# EAGLE design wifi-monome (EAGLE 9.1.0)
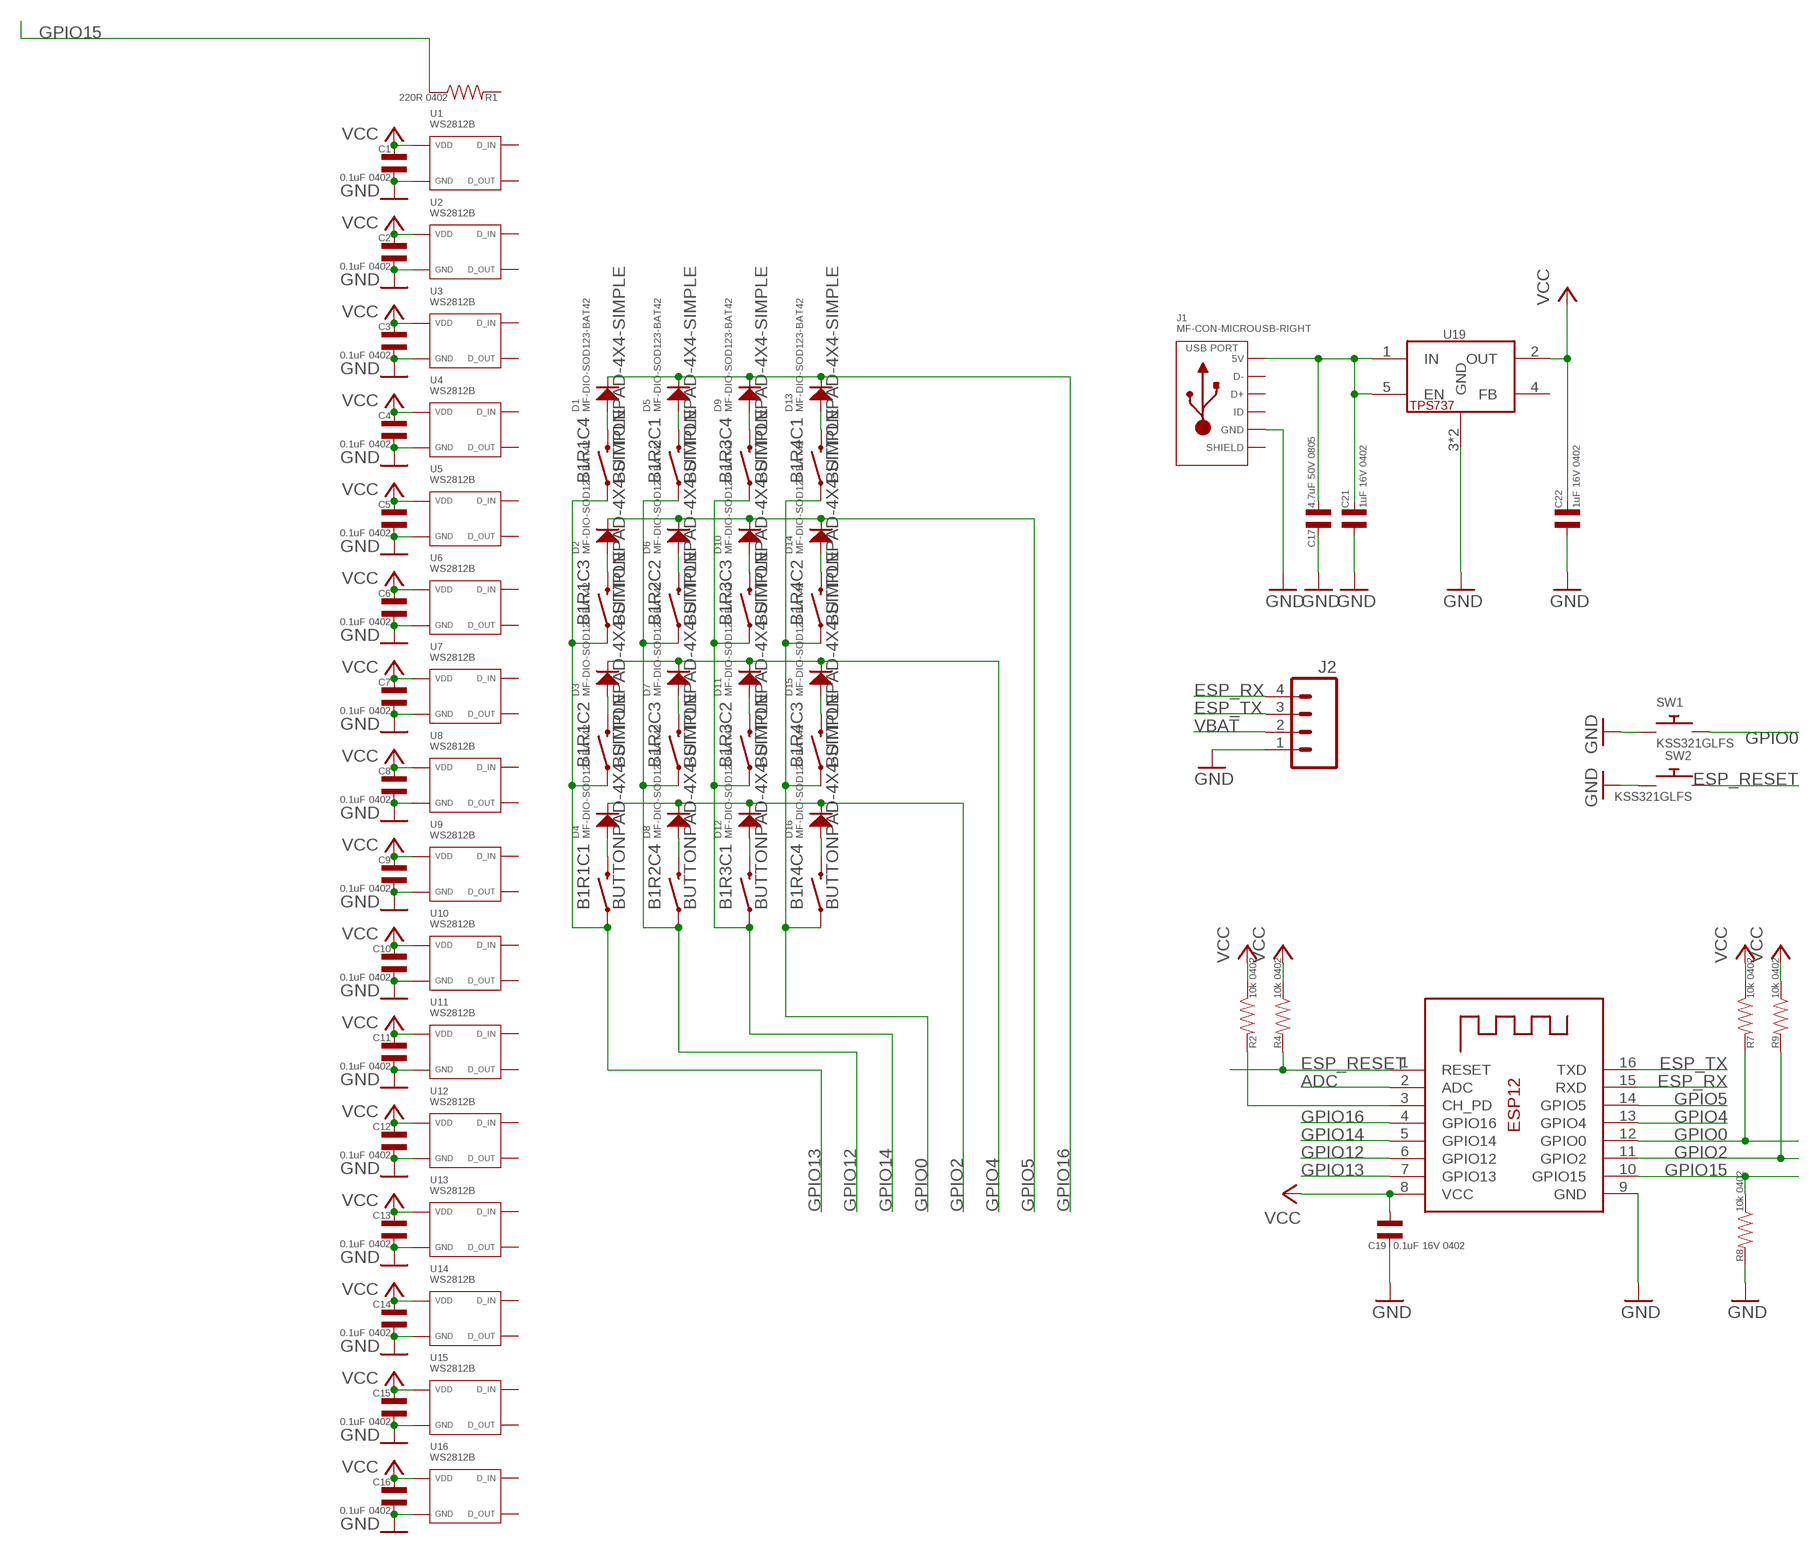
[diagram p0: schematic, sheet 1]

## Parts
B1  BUTTONPAD-4X4-SIMPLE  [BUTTONPAD-4X4-SIMPLE]
C1  0.1uF 0402  CAPACITOR_NP_0402  [C0402]
C2  0.1uF 0402  CAPACITOR_NP_0402  [C0402]
C3  0.1uF 0402  CAPACITOR_NP_0402  [C0402]
C4  0.1uF 0402  CAPACITOR_NP_0402  [C0402]
C5  0.1uF 0402  CAPACITOR_NP_0402  [C0402]
C6  0.1uF 0402  CAPACITOR_NP_0402  [C0402]
C7  0.1uF 0402  CAPACITOR_NP_0402  [C0402]
C8  0.1uF 0402  CAPACITOR_NP_0402  [C0402]
C9  0.1uF 0402  CAPACITOR_NP_0402  [C0402]
C10  0.1uF 0402  CAPACITOR_NP_0402  [C0402]
C11  0.1uF 0402  CAPACITOR_NP_0402  [C0402]
C12  0.1uF 0402  CAPACITOR_NP_0402  [C0402]
C13  0.1uF 0402  CAPACITOR_NP_0402  [C0402]
C14  0.1uF 0402  CAPACITOR_NP_0402  [C0402]
C15  0.1uF 0402  CAPACITOR_NP_0402  [C0402]
C16  0.1uF 0402  CAPACITOR_NP_0402  [C0402]
C17  4.7uF 50V 0805  CAPACITOR_NP_0805  [C0805]
C19  0.1uF 16V 0402  CAPACITOR_NP_0402  [C0402]
C21  1uF 16V 0402  CAPACITOR_NP_0402  [C0402]
C22  1uF 16V 0402  CAPACITOR_NP_0402  [C0402]
D1  MF-DIO-SOD123-BAT42  DIODES_BAT42_SOD-123  [SOD-123]
D2  MF-DIO-SOD123-BAT42  DIODES_BAT42_SOD-123  [SOD-123]
D3  MF-DIO-SOD123-BAT42  DIODES_BAT42_SOD-123  [SOD-123]
D4  MF-DIO-SOD123-BAT42  DIODES_BAT42_SOD-123  [SOD-123]
D5  MF-DIO-SOD123-BAT42  DIODES_BAT42_SOD-123  [SOD-123]
D6  MF-DIO-SOD123-BAT42  DIODES_BAT42_SOD-123  [SOD-123]
D7  MF-DIO-SOD123-BAT42  DIODES_BAT42_SOD-123  [SOD-123]
D8  MF-DIO-SOD123-BAT42  DIODES_BAT42_SOD-123  [SOD-123]
D9  MF-DIO-SOD123-BAT42  DIODES_BAT42_SOD-123  [SOD-123]
D10  MF-DIO-SOD123-BAT42  DIODES_BAT42_SOD-123  [SOD-123]
D11  MF-DIO-SOD123-BAT42  DIODES_BAT42_SOD-123  [SOD-123]
D12  MF-DIO-SOD123-BAT42  DIODES_BAT42_SOD-123  [SOD-123]
D13  MF-DIO-SOD123-BAT42  DIODES_BAT42_SOD-123  [SOD-123]
D14  MF-DIO-SOD123-BAT42  DIODES_BAT42_SOD-123  [SOD-123]
D15  MF-DIO-SOD123-BAT42  DIODES_BAT42_SOD-123  [SOD-123]
D16  MF-DIO-SOD123-BAT42  DIODES_BAT42_SOD-123  [SOD-123]
J1  MF-CON-MICROUSB-RIGHT  USB_MICRO_RIGHT  [MICROUSB-RIGHT]
J2  M04SMD_RA_FEMALE  [1X04_SMD_RA_FEMALE]
R1  220R 0402  RESISTOR_0402  [R0402]
R2  10k 0402  RESISTOR_0402  [R0402]
R4  10k 0402  RESISTOR_0402  [R0402]
R7  10k 0402  RESISTOR_0402  [R0402]
R8  10k 0402  RESISTOR_0402  [R0402]
R9  10k 0402  RESISTOR_0402  [R0402]
SW1  KSS321GLFS  SWITCH_PUSHBUTTONC&K_KSS  [BTN_CK_KSS]
SW2  KSS321GLFS  SWITCH_PUSHBUTTONC&K_KSS  [BTN_CK_KSS]
U1  WS2812B  [WS2812B]
U2  WS2812B  [WS2812B]
U3  WS2812B  [WS2812B]
U4  WS2812B  [WS2812B]
U5  WS2812B  [WS2812B]
U6  WS2812B  [WS2812B]
U7  WS2812B  [WS2812B]
U8  WS2812B  [WS2812B]
U9  WS2812B  [WS2812B]
U10  WS2812B  [WS2812B]
U11  WS2812B  [WS2812B]
U12  WS2812B  [WS2812B]
U13  WS2812B  [WS2812B]
U14  WS2812B  [WS2812B]
U15  WS2812B  [WS2812B]
U16  WS2812B  [WS2812B]
U19  TPS73733DCQR  TPS737  [SOT223-6]
X1  ESP-12e  ESP-12  [ESP-12]

## Nets
ADC: X1.2(ADC)
ESP_RESET: R4.P$2 SW2.P$1 X1.1(RESET)
ESP_RX: J2.4 X1.15(RXD)
ESP_TX: J2.3 X1.16(TXD)
GND [power]: C1.P$2 C2.P$2 C3.P$2 C4.P$2 C5.P$2 C6.P$2 C7.P$2 C8.P$2 C9.P$2 C10.P$2 C11.P$2 C12.P$2 C13.P$2 C14.P$2 C15.P$2 C16.P$2 C17.P$2 C19.P$2 C21.P$2 C22.P$2 J1.5(GND) J2.1 R8.P$2 SW1.P$1 SW2.P$2 U1.P$3(VSS) U2.P$3(VSS) U3.P$3(VSS) U4.P$3(VSS) U5.P$3(VSS) U6.P$3(VSS) U7.P$3(VSS) U8.P$3(VSS) U9.P$3(VSS) U10.P$3(VSS) U11.P$3(VSS) U12.P$3(VSS) U13.P$3(VSS) U14.P$3(VSS) U15.P$3(VSS) U16.P$3(VSS) U19.3(GND) U19.6(GND) X1.9(GND)
GPIO0: B1.SIG24 B1.SIG26 B1.SIG28 B1.SIG30 R7.P$2 SW1.P$2 X1.12(GPIO0)
GPIO2: D4.CATHODE D8.CATHODE D12.CATHODE D16.CATHODE R9.P$2 X1.11(GPIO2)
GPIO4: D3.CATHODE D7.CATHODE D11.CATHODE D15.CATHODE X1.13(GPIO4)
GPIO5: D2.CATHODE D6.CATHODE D10.CATHODE D14.CATHODE X1.14(GPIO5)
GPIO12: B1.SIG8 B1.SIG10 B1.SIG12 B1.SIG14 X1.6(GPIO12)
GPIO13: B1.SIG0 B1.SIG2 B1.SIG4 B1.SIG6 X1.7(GPIO13)
GPIO14: B1.SIG16 B1.SIG18 B1.SIG20 B1.SIG22 X1.5(GPIO14)
GPIO15: R1.P$1 R8.P$1 X1.10(GPIO15)
GPIO16: D1.CATHODE D5.CATHODE D9.CATHODE D13.CATHODE X1.4(GPIO16)
N$1: B1.SIG3 D3.ANODE
N$2: B1.SIG1 D4.ANODE
N$4 [power]: C17.P$1 C21.P$1 J1.1(5V) U19.1(IN) U19.5(EN)
N$7: B1.SIG15 D8.ANODE
N$8: B1.SIG17 D12.ANODE
N$9: B1.SIG31 D16.ANODE
N$10: B1.SIG19 D11.ANODE
N$11: B1.SIG13 D7.ANODE
N$12: B1.SIG29 D15.ANODE
N$13: B1.SIG27 D14.ANODE
N$14: B1.SIG21 D10.ANODE
N$15: B1.SIG11 D6.ANODE
N$16: B1.SIG5 D2.ANODE
N$17: B1.SIG7 D1.ANODE
N$18: B1.SIG9 D5.ANODE
N$19: B1.SIG23 D9.ANODE
N$20: B1.SIG25 D13.ANODE
N$57: R2.P$2 X1.3(CH_PD)
VBAT: J2.2
VCC [power]: C1.P$1 C2.P$1 C3.P$1 C4.P$1 C5.P$1 C6.P$1 C7.P$1 C8.P$1 C9.P$1 C10.P$1 C11.P$1 C12.P$1 C13.P$1 C14.P$1 C15.P$1 C16.P$1 C19.P$1 C22.P$1 R2.P$1 R4.P$1 R7.P$1 R9.P$1 U1.P$1(VDD) U2.P$1(VDD) U3.P$1(VDD) U4.P$1(VDD) U5.P$1(VDD) U6.P$1(VDD) U7.P$1(VDD) U8.P$1(VDD) U9.P$1(VDD) U10.P$1(VDD) U11.P$1(VDD) U12.P$1(VDD) U13.P$1(VDD) U14.P$1(VDD) U15.P$1(VDD) U16.P$1(VDD) U19.2(OUT) X1.8(VCC)
Unconnected: J1.2(D-) J1.3(D+) J1.4(ID) R1.P$2 U1.P$2(DOUT) U1.P$4(DIN) U2.P$2(DOUT) U2.P$4(DIN) U3.P$2(DOUT) U3.P$4(DIN) U4.P$2(DOUT) U4.P$4(DIN) U5.P$2(DOUT) U5.P$4(DIN) U6.P$2(DOUT) U6.P$4(DIN) U7.P$2(DOUT) U7.P$4(DIN) U8.P$2(DOUT) U8.P$4(DIN) U9.P$2(DOUT) U9.P$4(DIN) U10.P$2(DOUT) U10.P$4(DIN) U11.P$2(DOUT) U11.P$4(DIN) U12.P$2(DOUT) U12.P$4(DIN) U13.P$2(DOUT) U13.P$4(DIN) U14.P$2(DOUT) U14.P$4(DIN) U15.P$2(DOUT) U15.P$4(DIN) U16.P$2(DOUT) U16.P$4(DIN) U19.4(FB)

## Power pins joined to a net without a drawn wire
SLD: J1.S1(SLD) J1.S2(SLD) J1.S3(SLD) J1.S4(SLD) J1.S5(SLD) J1.S6(SLD)

## Library data of the parts
B1 = sonik:BUTTONPAD-4X4-SIMPLE
C1-C17 C19 C21 C22 = MF_Passives:CAPACITOR_NP: Library: MF_Passives Description: Device for Non-Polarized Capacitors. Manufacture part number (MPN) can be added via Attributes. Check https://factory.macrofab.com/parts for the house parts list.; POPULATE: 1
D1-D16 = MF_Discrete_Semiconductor:DIODES: Library: MF_Discrete_Semiconductor Description: Device for Single Packaged Diodes.; HOUSEPART: YES; MPN: MF-DIO-SOD123-BAT42; POPULATE: 1; URL: https://factory.macrofab.com/part/MF-DIO-SOD123-BAT42
J1 = MF_Connectors:USB: Library: MF_Connectors Description: 5 Pin USB Connectors. SLD is the shield connection. Usually tied to ground through a small ferrite bead.; HOUSEPART: YES; MPN: MF-CON-MICROUSB-RIGHT; POPULATE: 1; URL: https://factory.macrofab.com/part/MF-CON-MICROUSB-RIGHT
J2 = SparkFun-Connectors:M04: Header 4 Standard 4-pin 0.1" header. Use with straight break away headers (SKU : PRT-00116), right angle break away headers (PRT-00553), swiss pins (PRT-00743), machine pins (PRT-00117), and female headers (PRT-00115). Molex polarized connector foot print use with SKU : PRT-08231 with associated crimp pins and housings. 1MM SMD Version SKU: PRT-10208
R1 R2 R4 R7-R9 = MF_Passives:RESISTOR: Library: MF_Passives Description: Device for Resistors. Manufacture part number (MPN), Voltage, Tolerance, and Wattage Rating can be added via Attributes. Check https://factory.macrofab.com/parts for the house parts list.; POPULATE: 1
SW1 SW2 = adafruit:SWITCH_PUSHBUTTON: Buttons SOFTTOUCHSMD_SJ - Soft touch temporary push button (Super Junk Akihabara) Compatible with SKPMANE010 [Mouser: 688-SKPMAN] C&K_KSS = Digikey: KSS221GLFS
U1-U16 = MF_LEDs:WS2812B: Manufacturer Part #: WS2812B Manufacturer: WorldSemi Description: RGB LED with Intergrated Control Driver RGB; HOUSEPART: NO; MPN: WS2812B; POPULATE: 1; URL: https://cdn-shop.adafruit.com/datasheets/WS2812B.pdf
U19 = sonik:TPS737
X1 = adafruit:ESP-12

## Net classes
2 power: width 0.305 mm

## Board
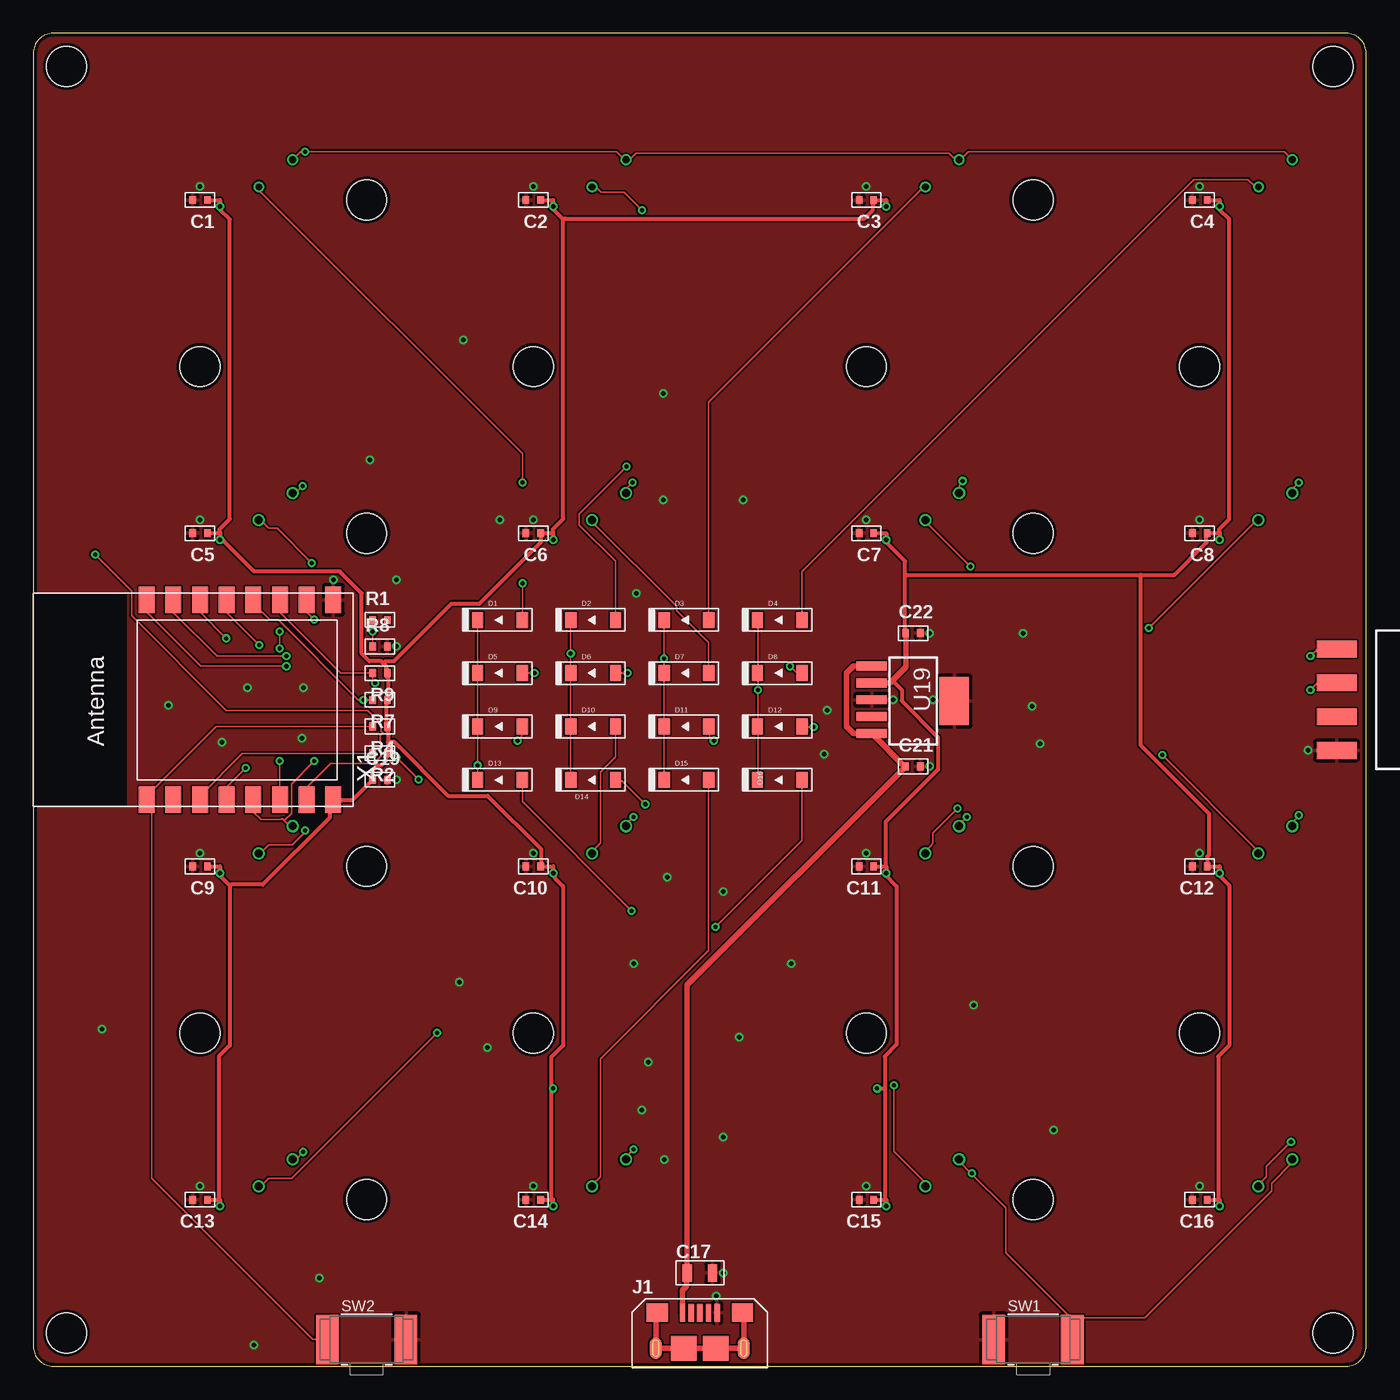
[diagram p1: board, top side]
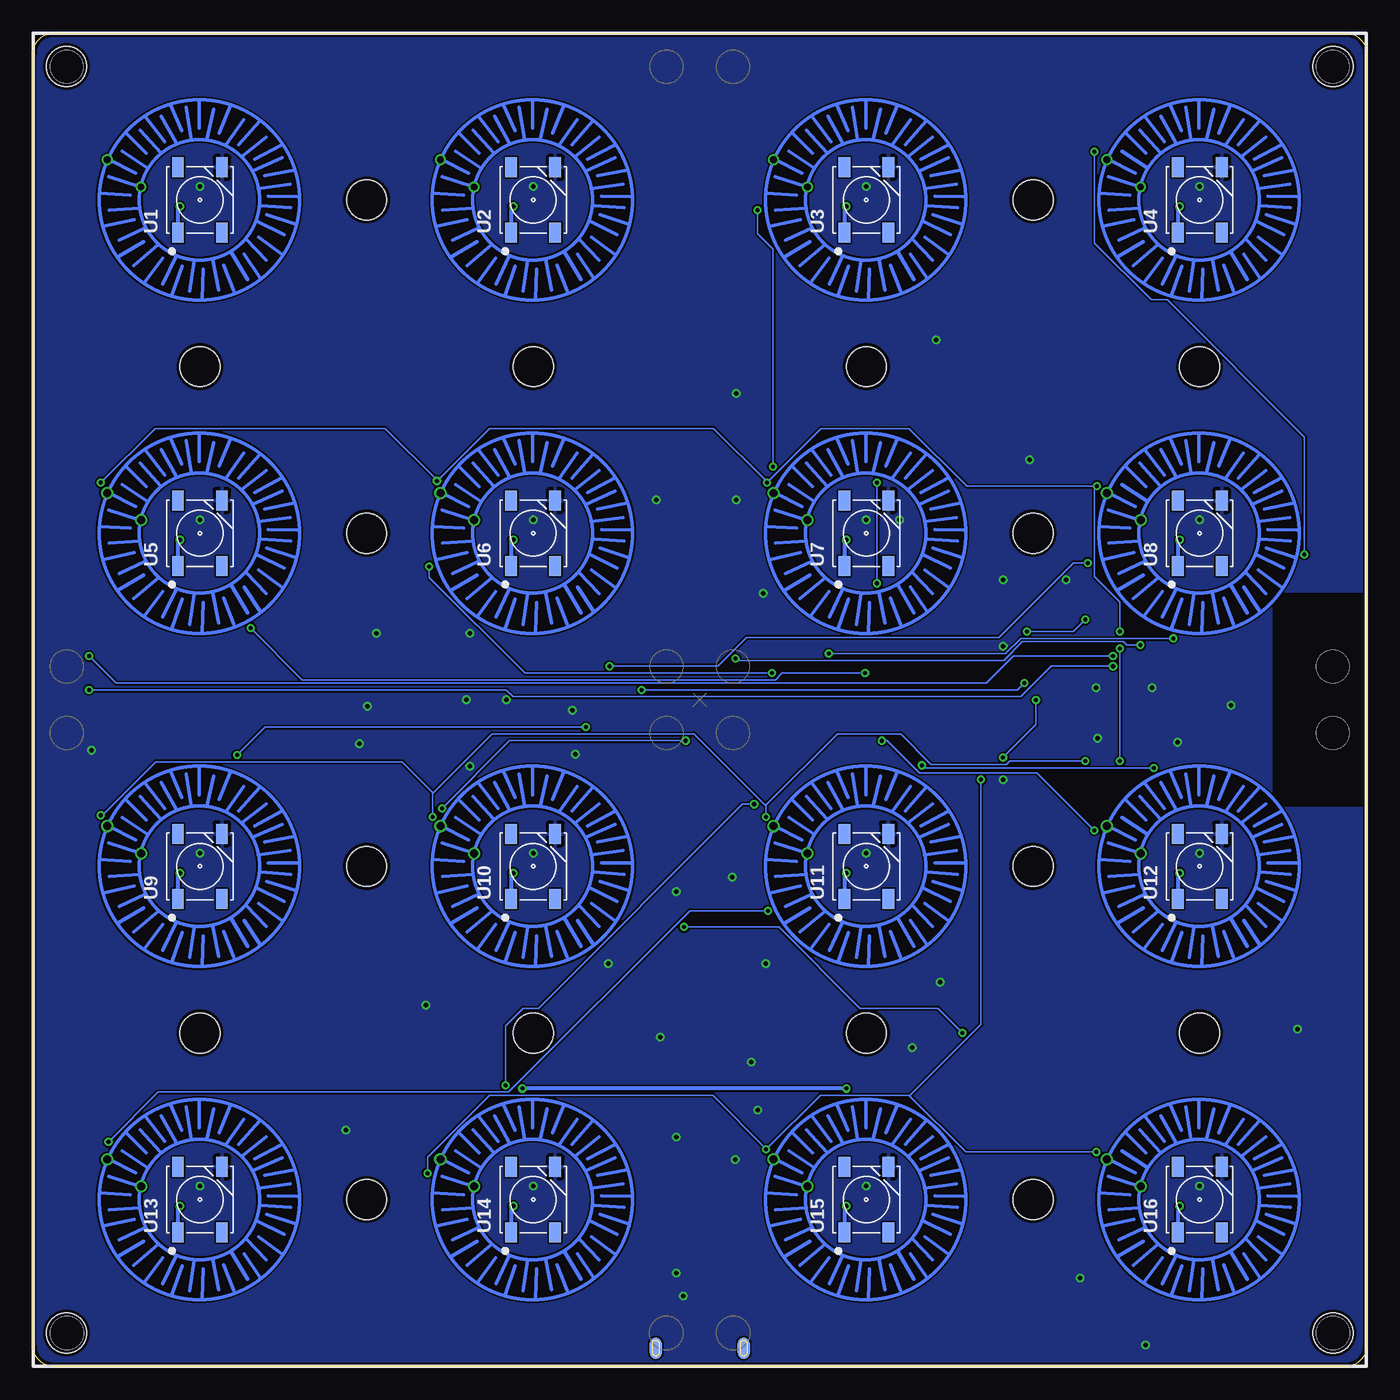
[diagram p2: board, bottom side, seen from below]

Size 100 x 100 mm. Coordinates in mm from the lower left corner, seen from the top.
Outline: 0,98.5 0,1.5 arc90 1.5,0 98.5,0 arc90 100,1.5 100,98.5 arc90 98.5,100 1.5,100 arc90 0,98.5
Copper layers (1*16): Top 0.035mm / dielectric 1.5mm / Bottom 0.035mm
Design rules "MF_Standard_2_Layer": minimum track width 5mil, minimum drill 12mil, track to track 5mil, track to pad 5mil, pad to pad 5mil, via to via 5mil, smd to smd 0mil, copper to edge 10mil, drill to drill 10mil, minimum pad ring 6mil, minimum via ring 6mil, stop-mask expansion 2mil, vias tented up to drill 25mil, thermal gap 10mil

### Footprints (pad centres in the part's own frame; a part is rotated, then mirrored left to right if it is on the bottom)
BUTTONPAD-4X4-SIMPLE = drill 0.508: SIG0 -44.462,40.513; SIG1 -41.922,38.481; SIG2 -19.462,40.513; SIG3 -16.922,38.481; SIG4 5.538,40.513; SIG5 8.078,38.481; SIG6 30.538,40.513; SIG7 33.078,38.481 | drill 0.6: SIG8 -44.462,15.513; SIG9 -41.922,13.481; SIG10 -19.462,15.513; SIG11 -16.922,13.481; SIG12 5.538,15.513; SIG13 8.078,13.481; SIG14 30.538,15.513; SIG15 33.078,13.481; SIG16 -44.462,-9.487; SIG17 -41.922,-11.519; SIG18 -19.462,-9.487; SIG19 -16.922,-11.519; SIG20 5.538,-9.487; SIG21 8.078,-11.519; SIG22 30.538,-9.487; SIG23 33.078,-11.519; SIG24 -44.462,-34.487; SIG25 -41.922,-36.519; SIG26 -19.462,-34.487; SIG27 -16.922,-36.519; SIG28 5.538,-34.487; SIG29 8.078,-36.519; SIG30 30.538,-34.487; SIG31 33.078,-36.519 | hole 3: -37.5,-25; -25,-12.5; -12.5,-25; -25,-37.5; 12.5,-25; 25,-12.5; 37.5,-25; 25,-37.5; -37.5,25; -25,37.5; -12.5,25; -25,12.5; 12.5,25; 25,37.5; 37.5,25; 25,12.5; -47.516,47.516; 47.516,47.516; 47.516,-47.516; -47.516,-47.516
C0402 = smd 0.5 x 0.6: P$1 -0.55,0; P$2 0.55,0
C0805 = smd 0.7 x 1.3: P$1 -0.95,0; P$2 0.95,0
SOD-123 = smd 0.85 x 1.2: ANODE 1.675,0; CATHODE -1.675,0
MICROUSB-RIGHT = smd 0.4 x 1.35: 1 -1.3,1.27; 2 -0.65,1.27; 3 0,1.27; 4 0.65,1.27; 5 1.3,1.27 | smd 0.9 x 1.6: S1 -3.3,-1.4; S2 3.3,-1.4 | smd 1.6 x 1.4: S3 -3.2,1.27; S4 3.2,1.27 | smd 1.9 x 1.9: S5 -1.2,-1.405; S6 1.2,-1.405 | smd 0.9 x 1.6 bottom: S7 -3.3,-1.4; S8 3.3,-1.4
1X04_SMD_RA_FEMALE = smd 1.25 x 3: 1 -3.81,7.225; 2 -1.27,7.225; 3 1.27,7.225; 4 3.81,7.225
R0402 = smd 0.5 x 0.6: P$1 -0.55,0; P$2 0.55,0
BTN_CK_KSS = smd 1.7 x 3.7: P$1 -2.95,0; P$2 2.95,0
WS2812B = smd 1.5 x 0.9: P$1 -2.45,1.65; P$2 -2.45,-1.65; P$3 2.45,-1.65; P$4 2.45,1.65
SOT223-6 = smd 0.67 x 2.27: 1 -2.54,-3.099; 2 -1.27,-3.099; 3 0,-3.099; 4 1.27,-3.099; 5 2.54,-3.099 | smd 3.6 x 2.2: 6 0.095,3.099
ESP-12 = smd 2 x 1.2: 1 -7.5,4.5; 2 -7.5,2.5; 3 -7.5,0.5; 4 -7.5,-1.5; 5 -7.5,-3.5; 6 -7.5,-5.5; 7 -7.5,-7.5; 8 -7.5,-9.5; 9 7.5,-9.5; 10 7.5,-7.5; 11 7.5,-5.5; 12 7.5,-3.5; 13 7.5,-1.5; 14 7.5,0.5; 15 7.5,2.5; 16 7.5,4.5

### Placement (x,y rotation side)
B1  50,50 0 bottom
C1  12.5,87.5 180 top
C2  37.5,87.5 180 top
C3  62.5,87.5 180 top
C4  87.5,87.5 180 top
C5  12.5,62.5 180 top
C6  37.5,62.5 180 top
C7  62.5,62.5 180 top
C8  87.5,62.5 180 top
C9  12.5,37.5 180 top
C10  37.5,37.5 180 top
C11  62.5,37.5 180 top
C12  87.5,37.5 180 top
C13  12.5,12.5 180 top
C14  37.5,12.5 180 top
C15  62.5,12.5 180 top
C16  87.5,12.5 180 top
C17  50,7 0 top
C19  26,44 0 top
C21  66,45 0 top
C22  66,55 0 top
D1  35,56 0 top
D2  42,56 0 top
D3  49,56 0 top
D4  56,56 0 top
D5  35,52 0 top
D6  42,52 0 top
D7  49,52 0 top
D8  56,52 0 top
D9  35,48 0 top
D10  42,48 0 top
D11  49,48 0 top
D12  56,48 0 top
D13  35,44 0 top
D14  42,44 0 top
D15  49,44 0 top
D16  56,44 0 top
J1  50,2.75 0 top
J2  105,50 90 top
R1  26,56 0 top
R2  26,46 180 top
R4  26,48 180 top
R7  26,50 180 top
R8  26,54 0 top
R9  26,52 180 top
SW1  75,2 0 top
SW2  25,2 0 top
U1  87.5,87.5 90 bottom
U2  62.5,87.5 90 bottom
U3  37.5,87.5 90 bottom
U4  12.5,87.5 90 bottom
U5  87.5,62.5 90 bottom
U6  62.5,62.5 90 bottom
U7  37.5,62.5 90 bottom
U8  12.5,62.5 90 bottom
U9  87.5,37.5 90 bottom
U10  62.5,37.5 90 bottom
U11  37.5,37.5 90 bottom
U12  12.5,37.5 90 bottom
U13  87.5,12.5 90 bottom
U14  62.5,12.5 90 bottom
U15  37.5,12.5 90 bottom
U16  12.5,12.5 90 bottom
U19  66,50 270 top
X1  13,50 90 top

### Tracks (layer width: path | path; a pad name or v marks a point on that pad's centre or on a via)
ESP_RESET
  Top 0.127: R4.P$2 25.4,48.01 13.72,48.01 8.51,42.8 8.51,42.55 X1.1 8.51,42.48 8.89,42.1 8.89,14.1 20.95,2.03 22.04,2.03 SW2.P$1
ESP_RX  (via drill 0.3)
  Top 0.127: v18.99,53.28 13.78,53.28 10.54,56.52 10.54,57.47 X1.15 | v95.82,53.28 96.33,53.78 97.73,53.78 J2.4
  Bottom 0.127: v18.99,53.28 26.48,53.28 28.51,51.24 93.79,51.24 v95.82,53.28
ESP_TX  (via drill 0.3)
  Top 0.127: v18.99,52.51 12.57,52.51 8.51,56.58 8.51,57.47 X1.16 | v95.82,50.74 96.33,51.24 97.73,51.24 J2.3
  Bottom 0.127: v18.99,52.51 23.62,52.51 25.91,50.23 64.01,50.23 64.52,50.74 v95.82,50.74
GND  (via drill 0.33)
  other vias: 37.5,13.5 12.5,13.5 62.5,13.5 87.5,13.5 87.5,38.5 62.5,38.5 37.5,38.5 12.5,38.5 12.5,63.5 37.5,63.5 62.5,63.5 87.5,63.5 87.5,88.5 62.5,88.5 37.5,88.5 12.5,88.5 64.5,50 67.5,50 67.25,55 67.25,45 22.5,59 27.25,54 27.25,44 51.75,7 51.25,5.25 27.25,59 25.25,68 32.25,77 47.25,73 47.25,65 45.25,58 53.25,65 74.25,55 59.55,49.2 59.35,45.9 47.55,36.7 51.75,35.6 45.05,30.2 31.95,28.8 34.05,23.9 46.15,22.8 45.65,19.2 51.75,17.2 47.35,15.5 52.95,24.7 56.85,30.2 70.55,27.1 76.55,17.7 75.55,46.7 74.95,49.5 95.65,46.2 35,63.5 20.25,50.9 16.05,50.9 10.15,49.6 14.15,46.8 20.15,47.1 5.15,25.3 16.55,1.6 21.45,6.6
  pour Top: 0,0 100,0 100,100 0,100
  pour Bottom: 0,0 100,0 100,100 0,100
GPIO0  (via drill 0.3)
  Top 0.127: 70.39,14.45 72.96,11.87 72.96,8.51 77.92,3.56 77.92,2.03 SW1.P$2 77.92,3.62 83.38,3.62 92.9,13.14 92.9,13.72 94.42,15.24 94.42,15.49 B1.SIG24 | 70.39,14.45 69.47,15.37 69.47,15.49 B1.SIG26 | R7.P$2 25.4,49.97 v24.77,49.97 24.38,49.97 18.35,56.01 17.72,56.01 16.51,57.21 16.51,57.47 X1.12 | v20.26,16.07 19.75,15.56 19.49,15.56 B1.SIG30 | v45.02,16.26 44.51,15.75 44.51,15.56 B1.SIG28 | v28.89,44.01 v27.24,45.66 | v70.42,14.48 70.39,14.45
  Bottom 0.127: v20.26,16.07 30.04,16.07 34.26,20.29 | 34.26,20.29 34.29,20.32 40.96,20.32 v45.02,16.26 45.02,16.32 49.02,20.32 65.79,20.32 70.42,15.68 v70.42,14.48 | v24.77,49.97 24.77,48.13 v27.24,45.66 | v28.89,44.01 28.89,25.65 34.26,20.29
GPIO2  (via drill 0.3)
  Top 0.127: D16.CATHODE 54.36,44.01 54.36,47.94 D12.CATHODE 54.36,48.01 v54.36,50.74 54.36,51.94 D8.CATHODE 54.36,52.01 54.36,55.94 D4.CATHODE | X1.11 18.54,57.47 18.54,56.52 23.05,52.01 25.4,52.01 R9.P$2 25.46,51.94 25.46,51.44 v25.65,51.24
  Bottom 0.127: v54.36,50.74 26.16,50.74 v25.65,51.24
GPIO4  (via drill 0.3)
  Top 0.127: D15.CATHODE 47.31,44.01 47.31,47.94 D11.CATHODE 47.31,48.01 47.31,51.94 D7.CATHODE 47.31,52.01 v47.31,53.09 47.31,55.94 D3.CATHODE | v16.95,54.1 14.54,56.52 14.54,57.47 X1.13
  Bottom 0.127: v16.95,54.1 17.97,54.1 18.22,54.36 25.78,54.36 27.18,52.96 47.18,52.96 v47.31,53.09
GPIO5  (via drill 0.3)
  Top 0.127: D14.CATHODE 40.32,47.94 D10.CATHODE 40.32,51.94 D6.CATHODE v40.32,53.47 40.32,55.94 D2.CATHODE | v14.48,54.61 12.51,56.58 12.51,57.47 X1.14
  Bottom 0.127: v14.48,54.61 25.91,54.61 27.05,53.47 v40.32,53.47
GPIO12  (via drill 0.3)
  Top 0.127: v20.19,66.04 19.68,65.53 19.49,65.53 B1.SIG14 | v44.96,66.29 44.51,65.85 44.51,65.53 B1.SIG12 | v69.72,66.42 69.72,66.36 69.47,66.1 69.47,65.53 B1.SIG10 | v94.93,66.29 94.49,65.85 94.49,65.53 B1.SIG8 | v18.48,45.4 18.48,42.55 X1.6 | v18.48,55.12 v18.48,53.85
  Bottom 0.127: 20.38,66.04 29.97,66.04 34.29,70.36 40.89,70.36 v44.96,66.29 44.96,66.36 48.96,70.36 65.79,70.36 v69.72,66.42 69.72,66.48 73.6,70.36 90.87,70.36 v94.93,66.29 | v18.48,53.85 v18.48,45.4 | v18.48,55.12 18.48,57.34 20.38,59.24 20.38,66.04 | 20.38,66.04 v20.19,66.04
GPIO13  (via drill 0.3)
  Top 0.127: B1.SIG6 19.49,90.55 20.07,91.12 v20.38,91.12 43.75,91.12 44.32,90.55 44.45,90.55 B1.SIG4 44.51,90.55 44.77,90.55 45.21,91 68.71,91 69.15,90.55 69.41,90.55 B1.SIG2 69.47,90.55 69.6,90.55 70.17,91.12 93.85,91.12 94.42,90.55 B1.SIG0 | v4.64,60.9 7.37,58.17 7.37,56.33 14.48,49.21 25.08,49.21 26.1,48.2 26.1,47.62 26.23,47.5 26.04,47.31 26.04,46.74 26.16,46.61 26.16,46.55 26.1,46.48 26.1,45.78 25.78,45.47 25.72,45.47 25.46,45.21 22.29,45.21 20.51,43.43 20.51,42.55 X1.7
  Bottom 0.127: v4.64,60.9 4.64,69.72 14.92,80.01 16.13,80.01 20.38,84.26 v20.38,91.12
GPIO14  (via drill 0.3)
  Top 0.127: B1.SIG22 19.24,40.51 18.83,40.93 | 18.83,40.93 18.67,41.08 18.61,41.02 17.08,41.02 16.51,41.59 16.51,42.48 X1.5 | v45.02,41.21 44.51,40.7 44.51,40.51 B1.SIG20 | v70.04,41.21 69.47,40.64 B1.SIG18 | v94.93,41.34 94.93,41.27 94.49,40.83 94.49,40.51 B1.SIG16 | 18.83,40.93 19.37,41.47 19.37,43.69 v21.08,45.4
  Bottom 0.127: v45.02,41.21 45.02,42.04 45.05,42.07 | 45.05,42.07 50.42,47.43 65.6,47.43 70.01,43.02 | 70.01,43.02 70.04,42.99 v70.04,41.21 | v94.93,41.34 94.81,41.34 90.81,45.34 72.33,45.34 70.01,43.02 | v21.08,45.4 26.73,45.4 26.99,45.15 32.64,45.15 34.92,47.43 39.69,47.43 45.05,42.07
GPIO15  (via drill 0.3)
  Top 0.127: R8.P$1 25.46,54.04 v25.46,55.12 25.46,55.94 R1.P$1 | v21.08,56.01 20.51,56.58 20.51,57.47 X1.10
  Bottom 0.127: v25.46,55.12 21.97,55.12 v21.08,56.01
GPIO16  (via drill 0.3)
  Top 0.127: D13.CATHODE v33.34,45.09 33.34,47.94 D9.CATHODE 33.34,51.94 D5.CATHODE 33.34,55.94 D1.CATHODE | v15.94,44.9 14.54,43.5 14.54,42.55 X1.4
  Bottom 0.127: v15.94,44.9 33.15,44.9 v33.34,45.09
N$1
  Top 0.127: D3.ANODE 50.67,72.33 66.86,88.52 B1.SIG3
N$2
  Top 0.127: D4.ANODE 57.66,56.01 57.66,59.63 87.06,89.03 91.12,89.03 91.63,88.52 91.89,88.52 B1.SIG1
N$4
  Top 0.305: 62.99,47.46 U19.5
  Top 0.406: J1.1 48.7,5.7 49,6 49,6.95 C17.P$1 49.05,28.6 C21.P$1 65.36,45 U19.5 61.54,47.46 61,48 61,52 61.54,52.54 U19.1
N$7  (via drill 0.3)
  Top 0.127: v56.77,52.51 57.28,52.01 57.66,52.01 D8.ANODE | v20.89,60.26 18.29,62.87 17.65,62.87 17.08,63.44 16.95,63.44 B1.SIG15
  Bottom 0.127: v56.77,52.51 48.64,52.51 46.48,54.67 27.56,54.67 21.97,60.26 v20.89,60.26
N$8  (via drill 0.3)
  Top 0.127: v58.55,47.94 57.72,47.94 D12.ANODE | v84.71,45.85 91.89,38.67 91.89,38.48 B1.SIG17
  Bottom 0.127: v58.55,47.94 82.61,47.94 v84.71,45.85
N$9  (via drill 0.3)
  Top 0.127: v51.18,32.96 57.66,39.43 57.66,43.94 D16.ANODE | v30.29,25.02 19.37,14.1 17.65,14.1 17.08,13.53 16.95,13.53 B1.SIG31
  Bottom 0.127: v51.18,32.96 44.07,32.96 37.97,26.86 32.13,26.86 v30.29,25.02
N$10  (via drill 0.3)
  Top 0.127: v51.05,46.93 50.74,47.24 50.74,47.94 D11.ANODE | v69.34,41.85 67.5,40.01 67.5,39.24 67.37,39.12 67.37,39.05 66.93,38.61 B1.SIG19
  Bottom 0.127: v51.05,46.93 64.26,46.93 v69.34,41.85
N$11
  Top 0.127: D7.ANODE 50.67,54.29 48.26,56.71 48.26,57.02 41.97,63.31 41.97,63.44 B1.SIG13
N$12
  Top 0.127: D15.ANODE 50.67,43.94 50.67,31.18 42.55,23.05 42.55,14.22 41.97,13.65 41.97,13.53 B1.SIG29
N$13  (via drill 0.3)
  Top 0.127: v45.91,42.16 44.13,43.94 43.69,43.94 D14.ANODE | v64.58,21.08 64.58,16.13 66.86,13.84 66.86,13.53 B1.SIG27
  Bottom 0.127: v45.91,42.16 46.8,42.16 62.1,26.86 63.25,26.86 64.58,25.53 v64.58,21.08
N$14
  Top 0.127: D10.ANODE 43.69,47.94 43.69,45.72 42.55,44.58 42.55,39.24 41.97,38.67 41.97,38.48 B1.SIG21
N$15  (via drill 0.3)
  Top 0.127: v44.58,52.01 43.69,52.01 D6.ANODE | v70.29,60.01 66.86,63.44 B1.SIG11
  Bottom 0.127: v44.58,52.01 63.12,52.01 70.29,59.18 v70.29,60.01
N$16  (via drill 0.3)
  Top 0.127: v44.51,67.5 40.96,63.94 40.96,63.12 43.69,60.39 43.69,56.01 D2.ANODE | v45.66,86.74 44.32,88.08 42.61,88.08 42.23,88.46 41.97,88.46 B1.SIG5
  Bottom 0.127: v44.51,67.5 44.51,83.82 45.66,84.96 v45.66,86.74
N$17  (via drill 0.3)
  Top 0.127: v36.7,58.74 36.7,56.01 D1.ANODE | v36.7,66.29 36.7,68.45 16.95,88.2 16.95,88.46 B1.SIG7
  Bottom 0.127: v36.7,66.29 v36.7,58.74
N$18  (via drill 0.3)
  Top 0.127: v37.59,52.01 36.7,52.01 D5.ANODE | v83.69,55.37 91.76,63.44 91.89,63.44 B1.SIG9
  Bottom 0.127: v37.59,52.01 43.81,52.01 44.32,51.5 79.82,51.5 v83.69,55.37
N$19  (via drill 0.3)
  Top 0.127: v36.32,46.93 36.64,47.24 36.64,47.94 D9.ANODE | v20.38,40.2 20.38,40.07 19.43,39.12 17.65,39.12 17.02,38.48 B1.SIG23
  Bottom 0.127: v36.32,46.93 35.94,46.93 33.53,44.51 24.7,44.51 v20.38,40.2
N$20  (via drill 0.3)
  Top 0.127: v44.9,34.16 36.7,42.35 36.7,43.94 D13.ANODE | v94.36,16.83 92.52,14.99 92.52,14.22 91.95,13.65 91.95,13.53 B1.SIG25
  Bottom 0.127: v44.9,34.16 50.74,34.16 64.33,20.57 90.61,20.57 v94.36,16.83
N$57
  Top 0.127: R2.P$2 25.4,45.97 15.68,45.97 12.51,42.8 12.51,42.55 X1.3
SLD
  Top 0.406: J1.S3 46.7,3.92 J1.S1 J1.S5 J1.S6 J1.S2 53.3,3.92 arc90 J1.S4
VCC  (via drill 0.3, 0.33)
  Top 0.305: C1.P$1 14,87.5 v14,87 14.03,86.87 14.03,86.74 14.73,86.04 14.73,63.56 13.97,62.8 13.97,62.61 14,62.5 | C2.P$1 39,87.5 v39,87 38.99,86.87 38.99,86.81 39.75,86.04 | v64,87 64,87.5 C3.P$1 63.06,87.38 63.06,87.19 62.99,87.12 62.99,86.74 62.36,86.11 39.88,86.11 39.75,86.04 | C4.P$1 89,87.5 v89,87 89.03,86.87 89.03,86.74 89.72,86.04 89.72,63.56 88.96,62.8 88.96,62.61 89,62.5 | 89,62.5 C8.P$1 88.01,62.36 88.01,61.78 85.6,59.37 83.06,59.37 | 89,62.5 v89,62 | C7.P$1 64,62.5 v64,62 64.01,61.85 64.01,61.78 65.41,60.39 65.41,59.37 | 39,62.5 C6.P$1 38.1,62.36 38.1,61.85 33.47,57.21 31.37,57.21 27.05,52.9 26.42,52.9 26.26,52.74 | 39,62.5 v39,62 | C5.P$1 14,62.5 | 14,62.5 v14,62 14.1,61.91 14.29,61.91 16.57,59.63 22.99,59.63 24.64,57.98 24.64,53.47 25.21,52.9 26.1,52.9 26.26,52.74 | C9.P$1 14,37.5 v14,37 13.91,36.89 14.73,36.07 | C11.P$1 64,37.5 | 64,37.5 v64,37 63.88,36.96 63.88,36.89 64.77,36.01 64.77,24.13 63.88,23.24 63.88,20.83 | C16.P$1 88.9,12.5 | 88.9,12.5 89,12.5 v89,12 | C15.P$1 63.88,12.5 | 63.88,12.5 64,12.5 v64,12 | C14.P$1 38.86,12.5 | 38.86,12.5 39,12.5 v39,12 | C13.P$1 13.91,12.5 | 13.91,12.5 14,12.5 v14,12 | 63.88,20.83 63.88,12.5 | 88.9,12.5 88.9,23.24 89.72,24.07 89.72,36.07 88.9,36.89 v89,37 89,37.5 C12.P$1 88.08,37.59 88.08,38.23 88.2,38.35 88.2,41.47 83.06,46.61 83.06,59.37 | 65.41,59.37 65.41,55.37 65.47,55.31 65.47,55.18 C22.P$1 | 65.41,59.37 83.06,59.37 | 64.44,51.44 65.15,50.74 65.15,49.91 67.88,47.18 67.88,44.77 63.94,40.83 63.94,37.59 64,37.5 | 38.86,20.83 38.86,23.18 39.75,24.07 39.75,36.01 39.12,36.64 39.12,36.77 39.05,36.83 39.12,36.89 39.12,36.96 v39,37 39,37.5 C10.P$1 38.1,37.59 38.1,38.8 34.1,42.8 31.11,42.8 27.05,46.86 26.61,46.86
  Top 0.305: 38.86,20.83 38.86,12.5 | 13.91,12.5 13.91,23.24 14.73,24.07 14.73,36.07 | 26.61,46.86 26.61,47.62 26.54,47.69 26.54,47.94 R4.P$1 26.54,48.13 26.54,48.32 26.48,48.39 26.48,49.66 26.54,49.72 26.54,49.85 R7.P$1 26.54,50.04 26.54,50.29 26.61,50.35 26.61,51.63 26.54,51.69 26.54,51.94 R9.P$1 26.54,52.13 26.54,52.32 26.48,52.39 26.48,52.51 26.26,52.74 | 26.61,46.86 26.61,46.35 26.54,46.29 26.54,46.04 R2.P$1 26.54,45.85 26.54,45.72 26.48,45.66 26.48,45.47 26.1,45.09 25.84,45.09 25.4,44.64 25.4,44.13 C19.P$1 23.95,42.5 X1.8 22.48,42.35 22.23,42.1 22.23,41.15 17.21,36.13 14.86,36.13 14.73,36.07 | 39.75,86.04 39.75,63.56 38.99,62.8 38.99,62.61 39,62.5 | v63.31,20.83 63.88,20.83 | v38.99,20.83 38.86,20.83
  Top 0.406: U19.2 64.27,51.27 64.44,51.44 65.45,52.45 C22.P$1
  Bottom 0.305: v14,87 14.15,87 U4.P$1 | v39,87 39.15,87 U3.P$1 | v64,87 64.15,87 U2.P$1 | v89,87 89.15,87 U1.P$1 | v89,62 89.15,62 U5.P$1 | v64,62 64.15,62 U6.P$1 | v39,62 39.15,62 U7.P$1 | v14,62 14.15,62 U8.P$1 | v14,37 14.15,37 U12.P$1 | v39,37 39.15,37 U11.P$1 | v64,37 64.15,37 U10.P$1 | v89,37 89.15,37 U9.P$1 | v89,12 89.15,12 U13.P$1 | v64,12 64.15,12 U14.P$1 | v39,12 39.15,12 U15.P$1 | v14,12 14.15,12 U16.P$1 | v38.99,20.83 v63.31,20.83